# Altium schematic sheet [02] BLOCK DIAGRAM.SchDoc
size A3; Organization: Altium Limited; Address1: L3, 12a Rodborough Rd; Address2: Frenchs Forest; Address3: NSW; Address4: Australia 2086
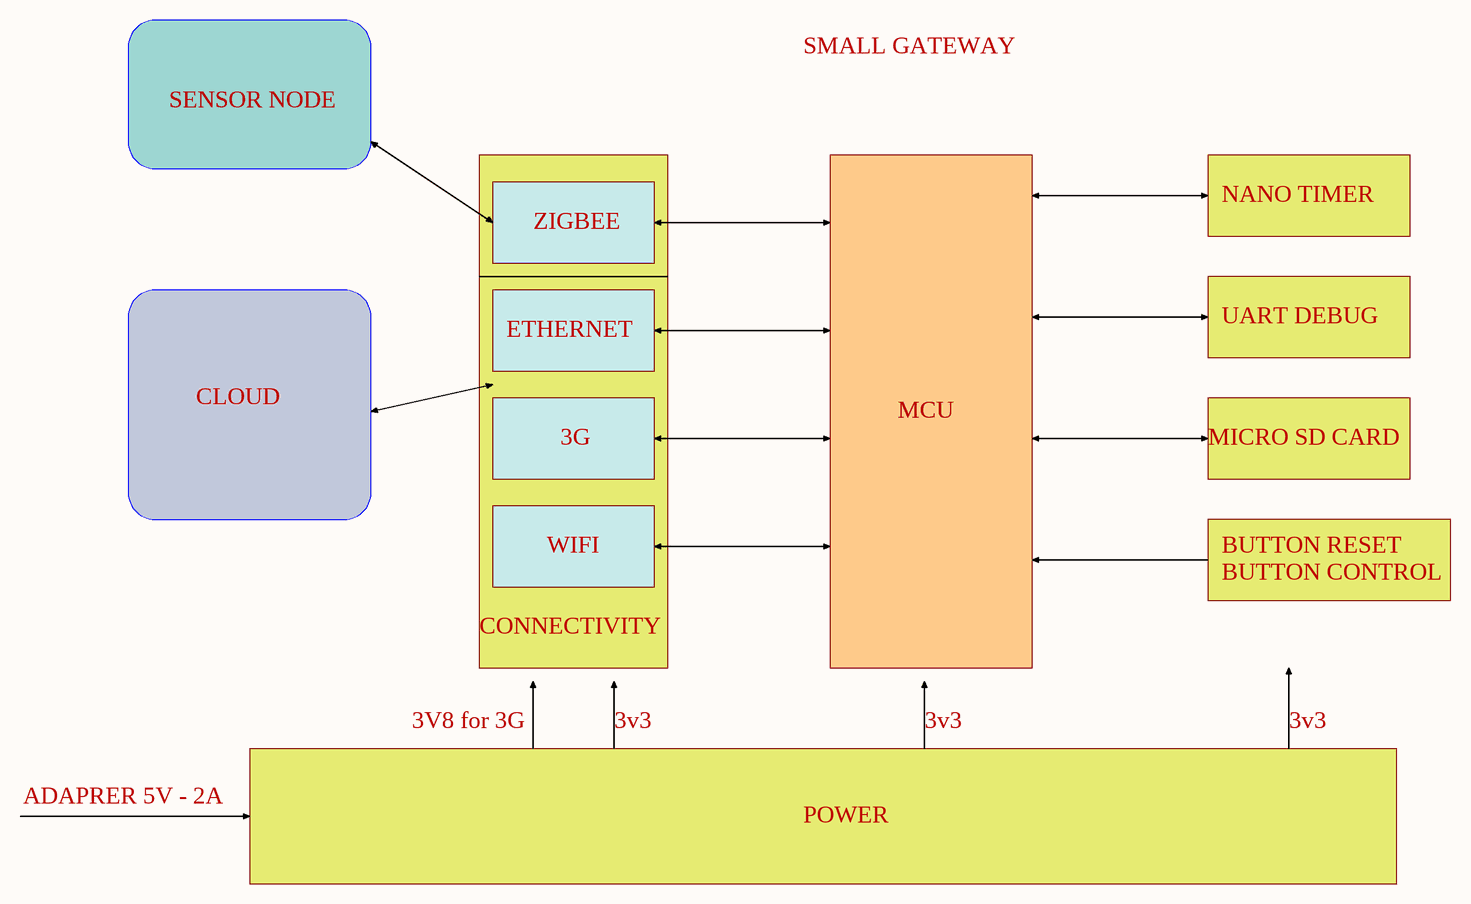
[diagram p0: [02] BLOCK DIAGRAM.SchDoc]

## Notes on the sheet
- SMALL GATEWAY
- SENSOR NODE
- NANO TIMER
- ZIGBEE
- ETHERNET
- UART DEBUG
- CLOUD
- MCU
- 3G
- MICRO SD CARD
- WIFI
- BUTTON RESET
- BUTTON CONTROL
- CONNECTIVITY
- 3V8 for 3G
- 3v3
- ADAPRER 5V - 2A
- POWER